# EasyEDA schematic SCH_ajax-mqtt_2022-05-22.json
TITLE: Sheet_1; REV: 1.0; Date: 2019-04-17; Sheet: 1/1; Drawn By: UserSupport; Company: Your Company
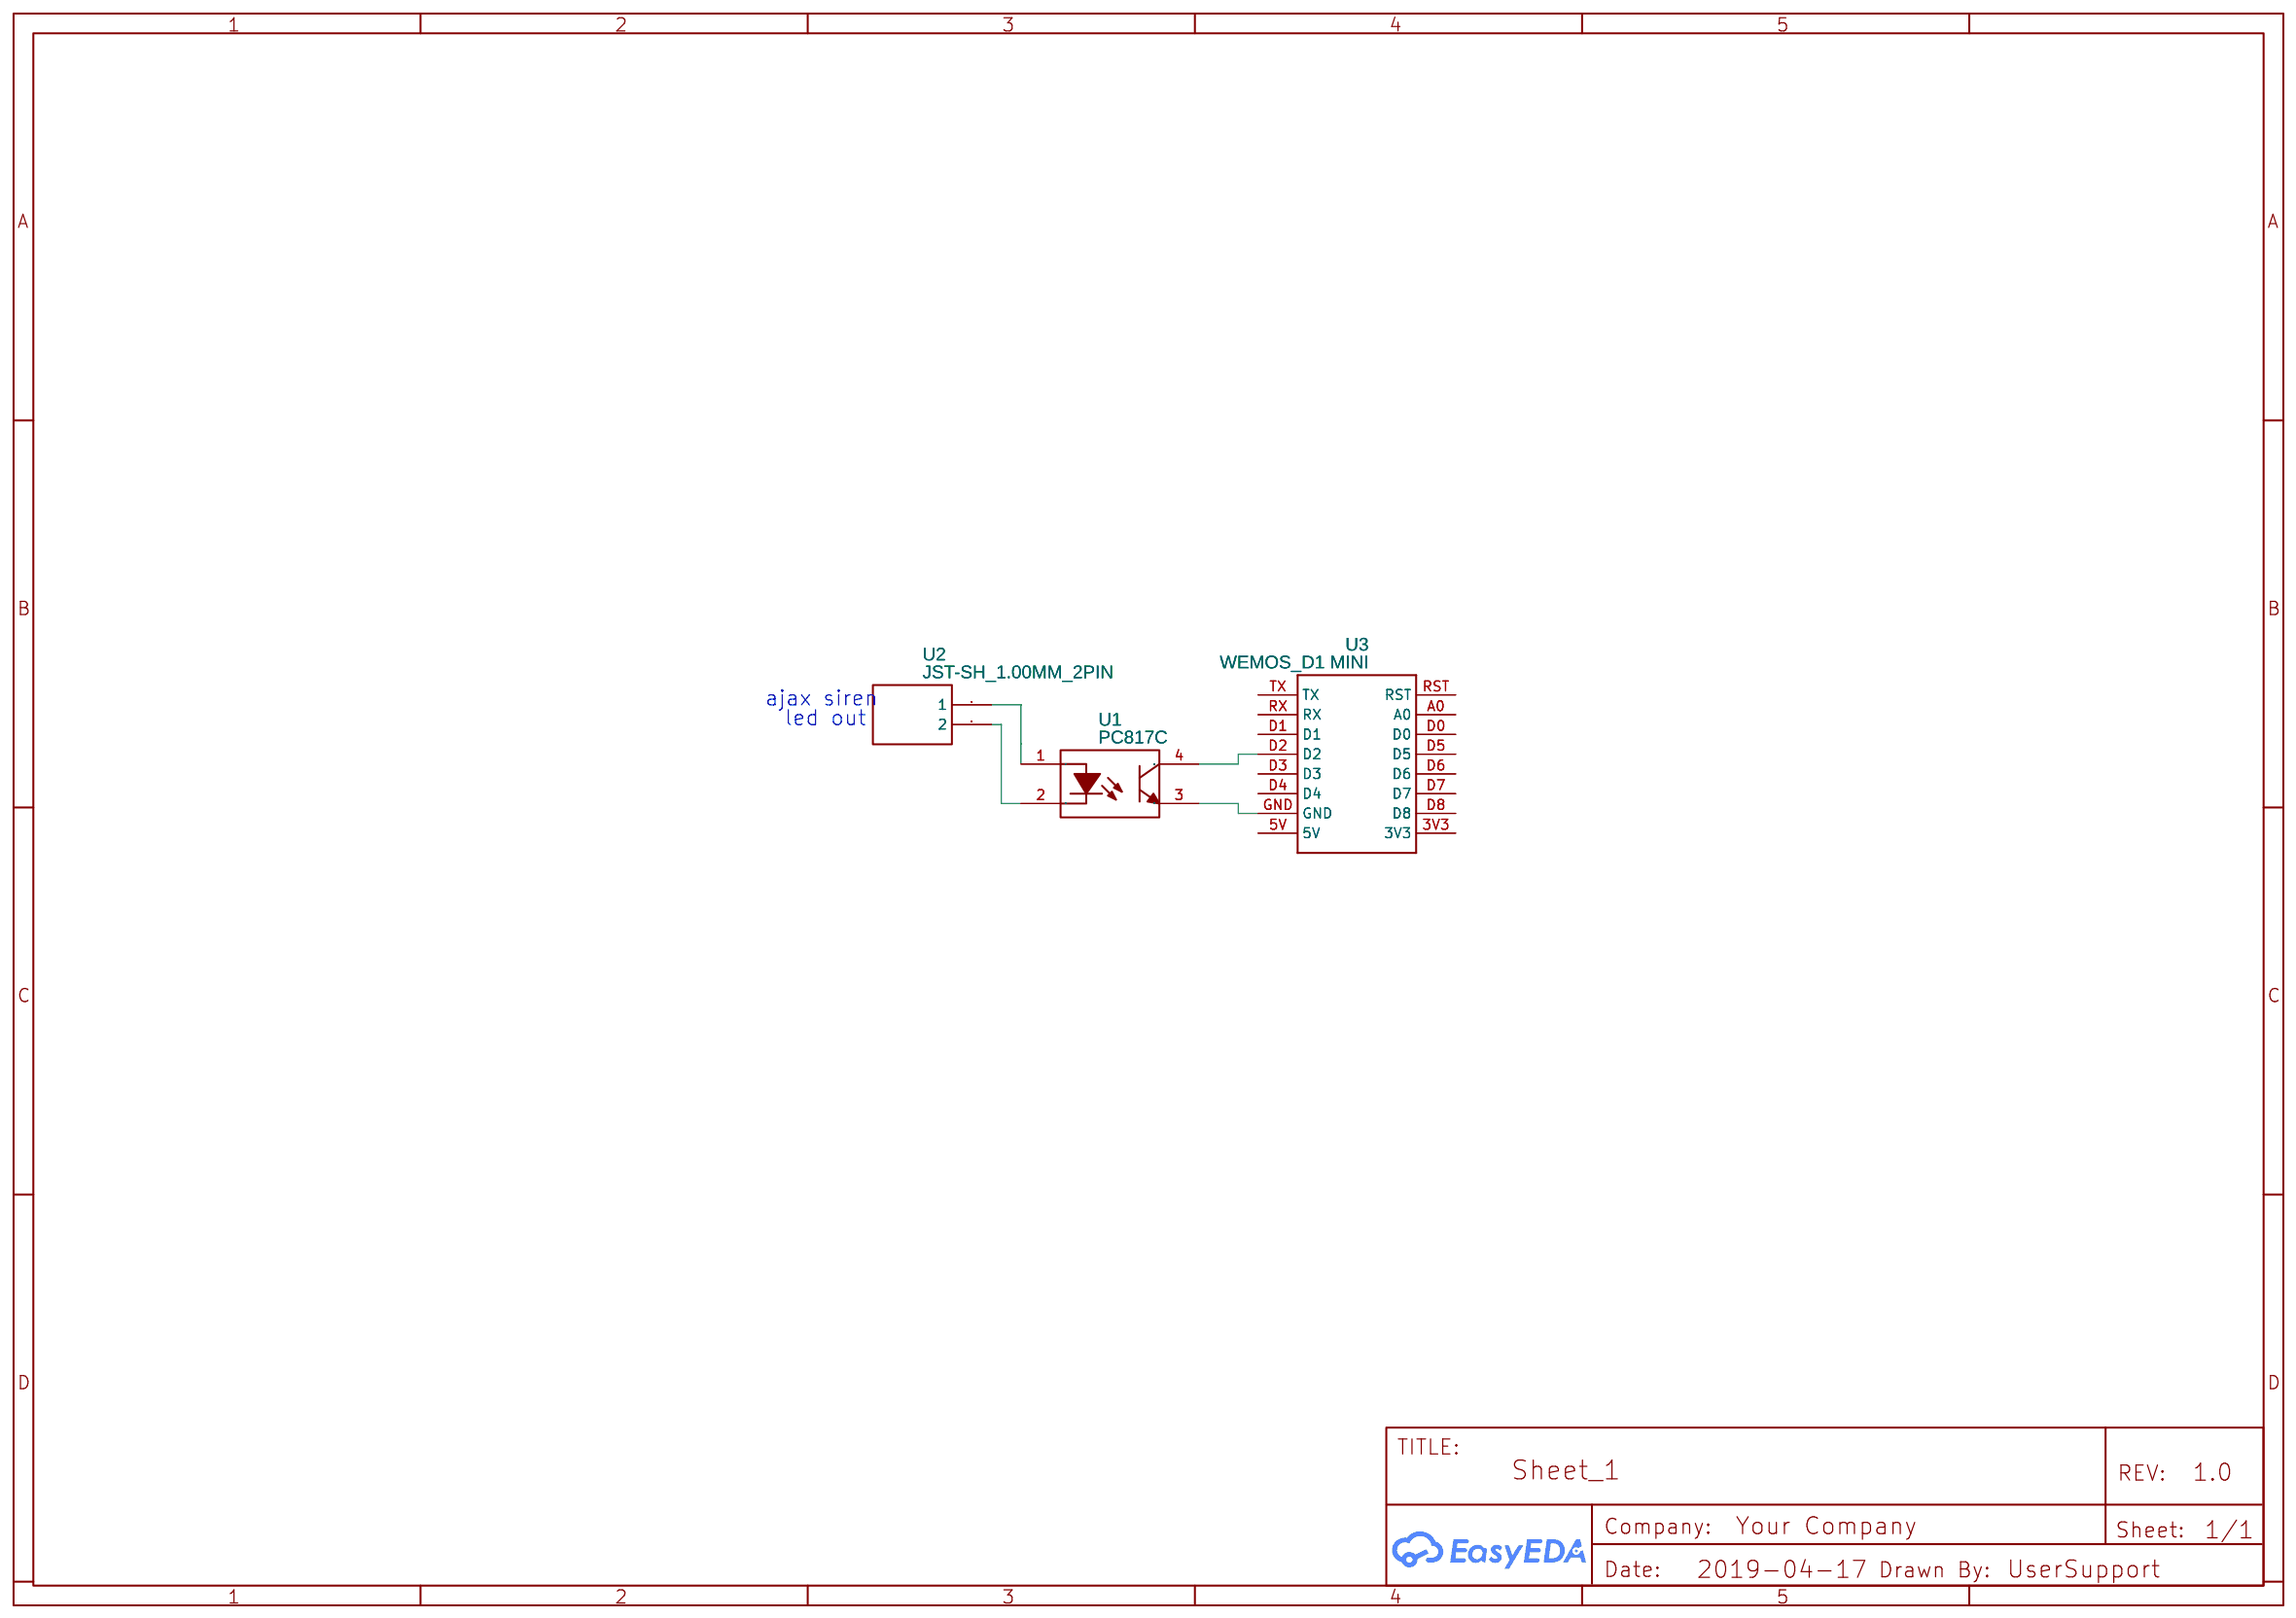
[diagram p0: schematic sheet]

## Parts
U1  PC817C  [DIP-4]
U2  JST-SH_1.00MM_2PIN  [JST-SH_1.00MM_8PIN]
U3  WEMOS_D1 MINI  [WEMOS D1 MINI]

## Library data of the parts
U1 = -: Supplier: LCSC; Supplier Part: C115500; Manufacturer: Wuxi China Resources Huajing Microelectronics; Contributor: LCSC
U2 = -: Manufacturer Part: ?; Supplier Part: undefined; Contributor: Henrik Petersen
U3 = -: sourceId: YemgaslDx; Contributor: Luan Cao; Manufacturer Part: ?

## Nets
Net-(U1-1): U1.1(AN) U2.1
Net-(U1-2): U1.2(CAT) U2.2
Net-(U1-3): U1.3(EM) U3.GND
Net-(U1-4): U1.4(COL) U3.D2

Not connected (* = marked no-connect by the designer): U3 3V3 5V A0 D0 D1 D3 D4 D5 D6 D7 D8 RST RX TX

## Notes on the sheet
- ajax siren
- led out
